# Altium schematic sheet Communicate_module.SchDoc: communicate_module
size A4; Date: 2018/10/8; Author: Wang Peirong; Revision: V1.1; SheetNumber: 6; Descripton: Can and Lin; pages: 6; Size: A4
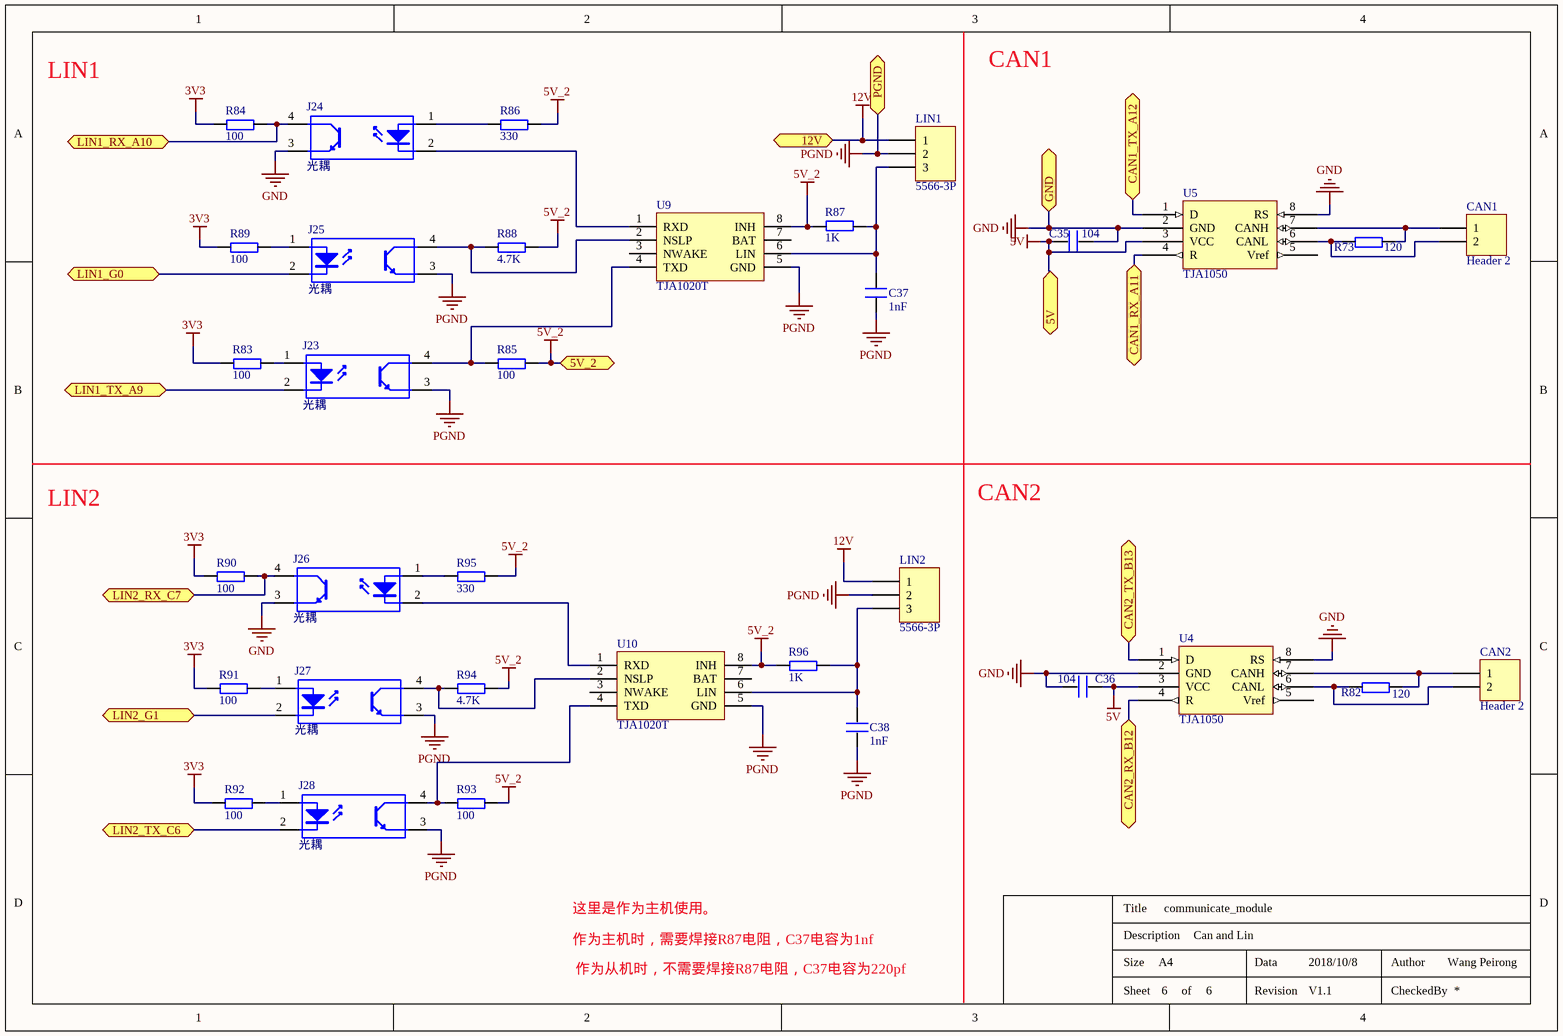
[diagram p0: Communicate_module.SchDoc]

## Parts
C35  104  [0603P]
C36  104  [0603P]
C37  1nF  [0603P]
C38  1nF  [0603P]
CAN1  Header 2  [5566-2P]
CAN2  Header 2  [5566-2P]
J23  光耦  [SOP127P710X350-4N]
J24  光耦  [SOP127P710X350-4N]
J25  光耦  [SOP127P710X350-4N]
J26  光耦  [SOP127P710X350-4N]
J27  光耦  [SOP127P710X350-4N]
J28  光耦  [SOP127P710X350-4N]
LIN1  5566-3P  [5566-3P]
LIN2  5566-3P  [5566-3P]
R73  120  [0603P]
R82  120  [0603P]
R83  100  [0603P]
R84  100  [0603P]
R85  100  [0603P]
R86  330  [0603P]
R87  1K  [0603P]
R88  4.7K  [0603P]
R89  100  [0603P]
R90  100  [0603P]
R91  100  [0603P]
R92  100  [0603P]
R93  100  [0603P]
R94  4.7K  [0603P]
R95  330  [0603P]
R96  1K  [0603P]
U4  TJA1050  [SOP-8]
U5  TJA1050  [SOP-8]
U9  TJA1020T  [NSO8_N]
U10  TJA1020T  [NSO8_N]

## Ports
5V, 5V_2, 12V, CAN1_RX_A11, CAN1_TX_A12, CAN2_RX_B12, CAN2_TX_B13, GND, LIN1_G0, LIN1_RX_A10, LIN1_TX_A9, LIN2_G1, LIN2_RX_C7, LIN2_TX_C6, PGND

## Nets
3V3: R83.1 R84.1 R89.1 R90.1 R91.1 R92.1
5V: C35.1 C36.2 U4.3(VCC) U5.3(VCC) ; port 5V
5V_2: R85.2 R86.2 R87.2 R88.2 R93.2 R94.2 R95.2 R96.1 U9.8(INH) U10.8(INH) ; port 5V_2
12V: LIN1.1 LIN2.1 ; port 12V
GND: C35.2 C36.1 J24.3(E) J26.3(E) U4.2(GND) U4.8(RS) U5.2(GND) U5.8(RS) ; port GND
PGND: C37.1 C38.1 J23.3(E) J25.3(E) J27.3(E) J28.3(E) LIN1.2 LIN2.2 U9.5(GND) U10.5(GND) ; port PGND
CAN1_RX_A11: U5.4(R) ; port CAN1_RX_A11
CAN1_TX_A12: U5.1(D) ; port CAN1_TX_A12
CAN2_RX_B12: U4.4(R) ; port CAN2_RX_B12
CAN2_TX_B13: U4.1(D) ; port CAN2_TX_B13
LIN1_G0: J25.2(K) ; port LIN1_G0
LIN1_RX_A10: J24.4(C) R84.2 ; port LIN1_RX_A10
LIN1_TX_A9: J23.2(K) ; port LIN1_TX_A9
LIN2_G1: J27.2(K) ; port LIN2_G1
LIN2_RX_C7: J26.4(C) R90.2 ; port LIN2_RX_C7
LIN2_TX_C6: J28.2(K) ; port LIN2_TX_C6
NetC37_2: C37.2 LIN1.3 R87.1 U9.6(LIN)
NetC38_2: C38.2 LIN2.3 R96.2 U10.6(LIN)
NetCAN1_1: CAN1.1 R73.2 U5.7(CANH)
NetCAN1_2: CAN1.2 R73.1 U5.6(CANL)
NetCAN2_1: CAN2.1 R82.2 U4.7(CANH)
NetCAN2_2: CAN2.2 R82.1 U4.6(CANL)
NetJ23_1: J23.1(A) R83.2
NetJ23_4: J23.4(C) R85.1 U9.4(TXD)
NetJ24_1: J24.1(A) R86.1
NetJ24_2: J24.2(K) U9.1(RXD)
NetJ25_1: J25.1(A) R89.2
NetJ25_4: J25.4(C) R88.1 U9.2(NSLP)
NetJ26_1: J26.1(A) R95.1
NetJ26_2: J26.2(K) U10.1(RXD)
NetJ27_1: J27.1(A) R91.2
NetJ27_4: J27.4(C) R94.1 U10.2(NSLP)
NetJ28_1: J28.1(A) R92.2
NetJ28_4: J28.4(C) R93.1 U10.4(TXD)

Not connected (* = marked no-connect by the designer): U4 5(Vref); U5 5(Vref); U9 3(NWAKE) 7(BAT); U10 3(NWAKE) 7(BAT)

## Notes on the sheet
- LIN1
- CAN1
- LIN2
- CAN2
- 这里是作为主机使用。
- 作为主机时，需要焊接R87电阻，C37电容为1nf
- 作为从机时，不需要焊接R87电阻，C37电容为220pf
- Title
- Description
- Size
- Data
- Author
- Sheet
- of
- Revision
- CheckedBy

## Library data of the parts
C35-C38 = C
CAN1 CAN2 = Header 2: Header, 2-Pin; LatestRevisionDate: 17-Jul-2002; LatestRevisionNote: Re-released for DXP Platform.; Publisher: Altium Limited
LIN1 LIN2 = Header 3: Header, 3-Pin; LatestRevisionDate: 17-Jul-2002; LatestRevisionNote: Re-released for DXP Platform.; Publisher: Altium Limited
R73 R82-R96 = R
U4 U5 = SN65HVD230D
J23-J28 = 光耦: Published: 24-Mar-1999; LatestRevisionDate: 04-Mar-2005; LatestRevisionNote: Sch pins 3 & 4 Swapped.; DatasheetDocument: Nov-2003; PackageReference: DIP-4; Publisher: Altium Limited